# EasyEDA schematic schematic.json
TITLE: New Schematic; REV: 1.0; Date: 2017-09-17; Sheet: 1/1; Drawn By: Your Name
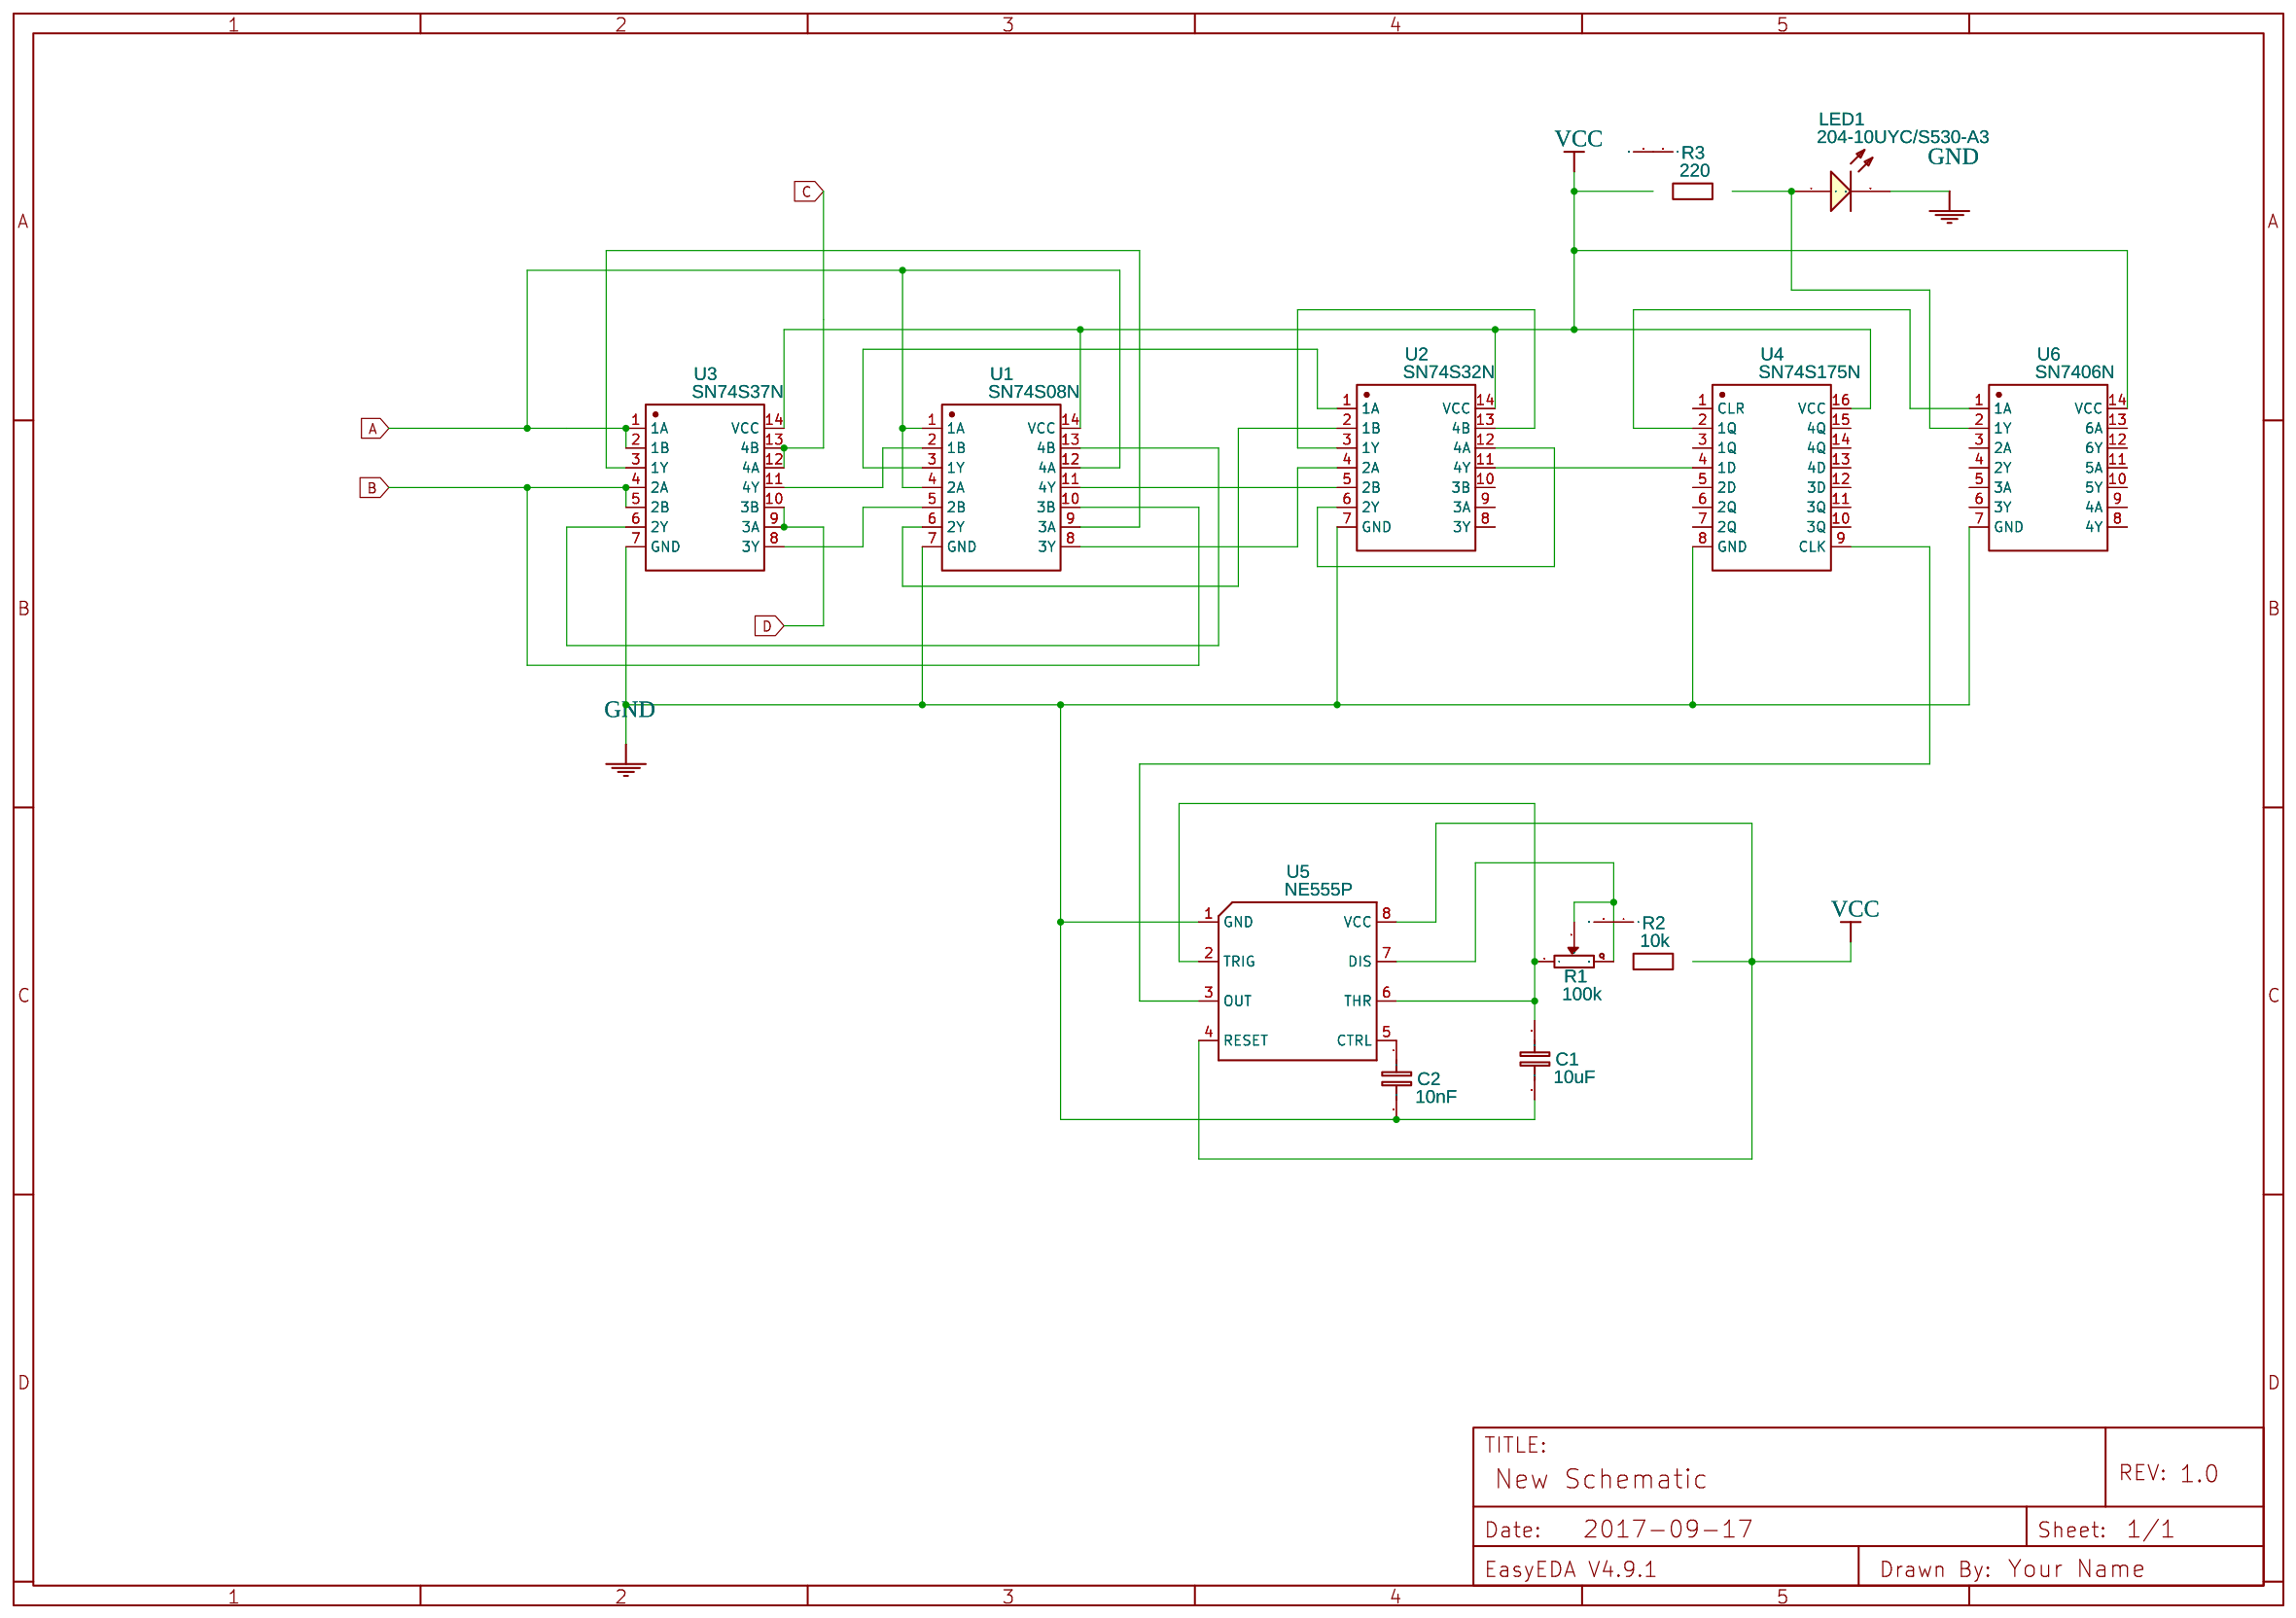
[diagram p0: schematic sheet]

## Parts
C1  10uF  [RAD-0.1]
C2  10nF  [RAD-0.1]
LED1  204-10UYC/S530-A3  [LED-3MM/2.54]
R1  100k  [RES-ADJ_3386P]
R2  10k  [AXIAL-0.3]
R3  220  [AXIAL-0.3]
U1  SN74S08N  [DIP14]
U2  SN74S32N  [DIP14]
U3  SN74S37N  [DIP14]
U4  SN74S175N  [DIP16]
U5  NE555P  [DIP8-2.54-10.9X6.6MM]
U6  SN7406N  [DIP14]

## Library data of the parts
C1 C2 = Capacitor: Manufacturer Part: ?
LED1 = -: LCSC: C73643; Supplier: LCSC; Manufacturer: EVERLIGHT
R1 = Potentiometer: K(%): 50; Manufacturer Part: ?
R2 R3 = Resistor: Manufacturer Part: ?
U1-U4 U6 = -: Manufacturer Part: ?
U5 = -: DIP IC Clock/Timing; catid: 20; sourceId: 2CwqICTb5

## Nets
GND: C1.2 C2.2 LED1.2(C) U1.7(GND) U2.7(GND) U3.7(GND) U4.8(GND) U5.1(GND) U6.7(GND)
VCC: R2.2 R3.1 U1.14(VCC) U2.14(VCC) U3.14(VCC) U4.16(VCC) U5.4(RESET) U5.8(VCC) U6.14(VCC)
A: U1.1(1A) U1.4(2A) U1.12(4A) U3.1(1A) U3.2(1B)
B: U1.10(3B) U3.4(2A) U3.5(2B)
C: U3.12(4A) U3.13(4B)
D: U3.9(3A) U3.10(3B)
Net-(C1-1): C1.1 R1.1 U5.2(TRIG) U5.6(THR)
Net-(C2-1): C2.1 U5.5(CTRL)
Net-(LED1-1): LED1.1(A) R3.2 U6.2(1Y)
Net-(R1-2): R1.2(3) R1.3(2) R2.1 U5.7(DIS)
Net-(U1-2): U1.2(1B) U3.11(4Y)
Net-(U1-3): U1.3(1Y) U2.1(1A)
Net-(U1-5): U1.5(2B) U3.8(3Y)
Net-(U1-6): U1.6(2Y) U2.2(1B)
Net-(U1-8): U1.8(3Y) U2.4(2A)
Net-(U1-9): U1.9(3A) U3.3(1Y)
Net-(U1-11): U1.11(4Y) U2.5(2B)
Net-(U1-13): U1.13(4B) U3.6(2Y)
Net-(U2-3): U2.3(1Y) U2.13(4B)
Net-(U2-6): U2.6(2Y) U2.12(4A)
Net-(U2-11): U2.11(4Y) U4.4(1D)
Net-(U4-2): U4.2(1Q) U6.1(1A)
Net-(U4-9): U4.9(CLK) U5.3(OUT)

Not connected (* = marked no-connect by the designer): U2 8(3Y) 9(3A) 10(3B); U4 1(CLR) 3(1Q) 5(2D) 6(2Q) 7(2Q) 10(3Q) 11(3Q) 12(3D) 13(4D) 14(4Q) 15(4Q); U6 3(2A) 4(2Y) 5(3A) 6(3Y) 8(4Y) 9(4A) 10(5Y) 11(5A) 12(6Y) 13(6A)
